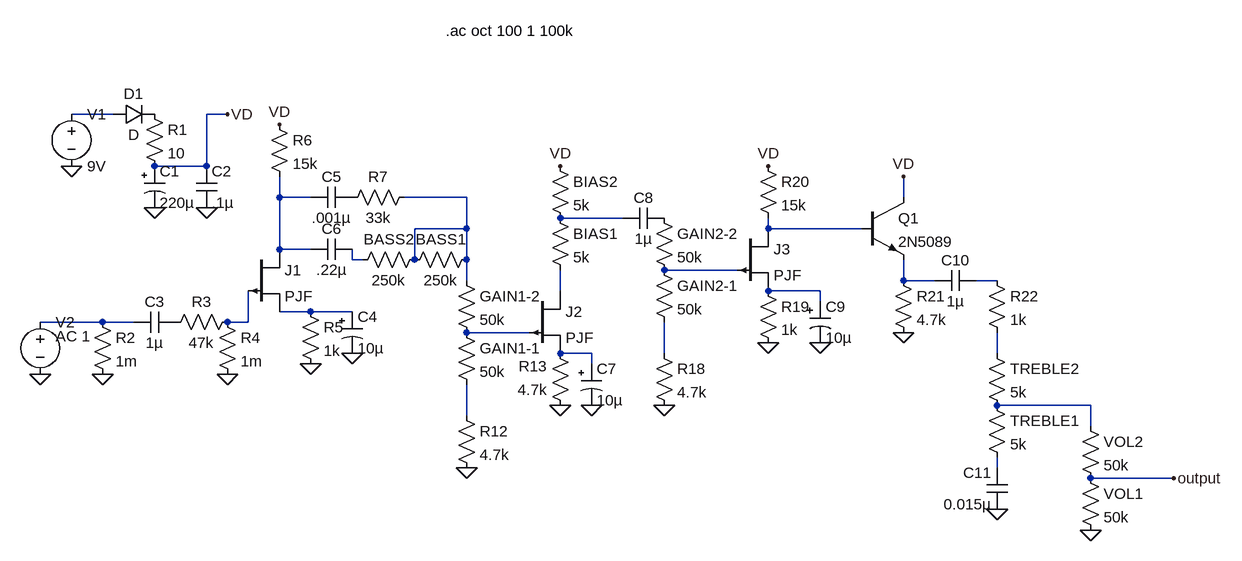
[diagram p0: schematic ssbs mini.asc]
ssbs mini.asc, the LTspice schematic file:
Version 4
SHEET 1 1656 736
WIRE -64 80 -128 80
WIRE 112 80 80 80
WIRE 80 160 80 80
WIRE 80 160 0 160
WIRE 192 208 192 176
WIRE 240 208 192 208
WIRE 480 208 384 208
WIRE 1152 208 1152 176
WIRE 720 240 624 240
WIRE 480 256 480 208
WIRE 480 256 400 256
WIRE 944 256 944 240
WIRE 1088 256 944 256
WIRE 944 272 944 256
WIRE 192 288 192 208
WIRE 240 288 192 288
WIRE 304 304 304 288
WIRE 320 304 304 304
WIRE 400 304 400 256
WIRE 480 304 480 256
WIRE 896 320 784 320
WIRE 480 336 480 304
WIRE 1152 336 1152 304
WIRE 1200 336 1152 336
WIRE 1296 336 1264 336
WIRE 624 352 624 320
WIRE 1024 352 944 352
WIRE 1024 368 1024 352
WIRE 240 384 192 384
WIRE 304 384 240 384
WIRE -80 400 -176 400
WIRE -32 400 -80 400
WIRE 144 400 144 352
WIRE 144 400 112 400
WIRE 576 416 480 416
WIRE 672 448 624 448
WIRE 784 448 784 400
WIRE 1296 448 1296 416
WIRE 672 464 672 448
WIRE 1440 528 1296 528
WIRE 480 544 480 496
WIRE 1440 560 1440 528
WIRE 1296 624 1296 608
WIRE 1568 640 1440 640
FLAG -128 160 0
FLAG -176 480 0
FLAG 0 224 0
FLAG 80 224 0
FLAG 112 80 VD
FLAG 112 480 0
FLAG -80 480 0
FLAG 240 464 0
FLAG 304 448 0
FLAG 192 96 VD
FLAG 480 624 0
FLAG 624 528 0
FLAG 672 528 0
FLAG 624 160 VD
FLAG 784 528 0
FLAG 944 432 0
FLAG 1024 432 0
FLAG 944 160 VD
FLAG 1152 176 VD
FLAG 1152 416 0
FLAG 1296 688 0
FLAG 1440 720 0
FLAG 1568 640 output
SYMBOL voltage -128 64 R0
SYMATTR InstName V1
SYMATTR Value 9V
SYMBOL voltage -176 384 R0
WINDOW 123 24 38 Left 2
SYMATTR Value2 AC 1
SYMATTR InstName V2
SYMATTR Value ""
SYMBOL diode -64 96 R270
WINDOW 0 32 32 VTop 2
WINDOW 3 0 32 VBottom 2
SYMATTR InstName D1
SYMBOL res -16 64 R0
SYMATTR InstName R1
SYMATTR Value 10
SYMBOL polcap -16 160 R0
SYMATTR InstName C1
SYMATTR Value 220µ
SYMBOL cap 64 160 R0
SYMATTR InstName C2
SYMATTR Value .1µ
SYMBOL res -96 384 R0
SYMATTR InstName R2
SYMATTR Value 1m
SYMBOL cap 32 384 R90
WINDOW 0 0 32 VBottom 2
WINDOW 3 32 32 VTop 2
SYMATTR InstName C3
SYMATTR Value 1µ
SYMBOL res 128 384 R90
WINDOW 0 0 56 VBottom 2
WINDOW 3 32 56 VTop 2
SYMATTR InstName R3
SYMATTR Value 47k
SYMBOL res 96 384 R0
SYMATTR InstName R4
SYMATTR Value 1m
SYMBOL res 224 368 R0
SYMATTR InstName R5
SYMATTR Value 1k
SYMBOL polcap 288 384 R0
SYMATTR InstName C4
SYMATTR Value 10µ
SYMBOL pjf 144 288 R0
SYMATTR InstName J1
SYMBOL res 176 80 R0
SYMATTR InstName R6
SYMATTR Value 15k
SYMBOL cap 304 192 R90
WINDOW 0 0 32 VBottom 2
WINDOW 3 32 32 VTop 2
SYMATTR InstName C5
SYMATTR Value .001µ
SYMBOL cap 304 272 R90
WINDOW 0 0 32 VBottom 2
WINDOW 3 32 32 VTop 2
SYMATTR InstName C6
SYMATTR Value .22µ
SYMBOL res 400 192 R90
WINDOW 0 0 56 VBottom 2
WINDOW 3 32 56 VTop 2
SYMATTR InstName R7
SYMATTR Value 33k
SYMBOL res 416 288 R90
WINDOW 0 0 56 VBottom 2
WINDOW 3 32 56 VTop 2
SYMATTR InstName BASS2
SYMATTR Value 250k
SYMBOL res 496 288 R90
WINDOW 0 0 56 VBottom 2
WINDOW 3 32 56 VTop 2
SYMATTR InstName BASS1
SYMATTR Value 250k
SYMBOL res 464 320 R0
SYMATTR InstName GAIN1-2
SYMATTR Value 50k
SYMBOL res 464 400 R0
SYMATTR InstName GAIN1-1
SYMATTR Value 50k
SYMBOL res 464 528 R0
SYMATTR InstName R12
SYMATTR Value 4.7k
SYMBOL pjf 576 352 R0
SYMATTR InstName J2
SYMBOL res 640 544 R180
WINDOW 0 36 76 Left 2
WINDOW 3 36 40 Left 2
SYMATTR InstName R13
SYMATTR Value 4.7k
SYMBOL polcap 656 464 R0
SYMATTR InstName C7
SYMATTR Value 10µ
SYMBOL res 608 224 R0
SYMATTR InstName BIAS1
SYMATTR Value 5k
SYMBOL res 608 144 R0
SYMATTR InstName BIAS2
SYMATTR Value 5k
SYMBOL cap 784 224 R90
WINDOW 0 0 32 VBottom 2
WINDOW 3 32 32 VTop 2
SYMATTR InstName C8
SYMATTR Value 1µ
SYMBOL res 768 224 R0
SYMATTR InstName GAIN2-2
SYMATTR Value 50k
SYMBOL res 768 304 R0
SYMATTR InstName GAIN2-1
SYMATTR Value 50k
SYMBOL res 768 432 R0
SYMATTR InstName R18
SYMATTR Value 4.7k
SYMBOL pjf 896 256 R0
SYMATTR InstName J3
SYMBOL res 928 336 R0
SYMATTR InstName R19
SYMATTR Value 1k
SYMBOL res 928 144 R0
SYMATTR InstName R20
SYMATTR Value 15k
SYMBOL polcap 1008 368 R0
SYMATTR InstName C9
SYMATTR Value 10µ
SYMBOL npn 1088 208 R0
SYMATTR InstName Q1
SYMATTR Value 2N5089
SYMBOL res 1136 320 R0
SYMATTR InstName R21
SYMATTR Value 4.7k
SYMBOL res 1280 320 R0
SYMATTR InstName R22
SYMATTR Value 1k
SYMBOL res 1280 432 R0
SYMATTR InstName TREBLE2
SYMATTR Value 5k
SYMBOL res 1280 512 R0
SYMATTR InstName TREBLE1
SYMATTR Value 5k
SYMBOL res 1424 544 R0
SYMATTR InstName VOL2
SYMATTR Value 50k
SYMBOL res 1424 624 R0
SYMATTR InstName VOL1
SYMATTR Value 50k
SYMBOL cap 1264 320 R90
WINDOW 0 0 32 VBottom 2
WINDOW 3 32 32 VTop 2
SYMATTR InstName C10
SYMATTR Value 1µ
SYMBOL cap 1312 688 R180
WINDOW 0 24 56 Left 2
WINDOW 3 24 8 Left 2
SYMATTR InstName C11
SYMATTR Value 0.015µ
TEXT 448 -48 Left 2 !.ac oct 100 1 100k

The netlist it stands for:
* ssbs mini.asc
V1 N001 0 9V
V2 N013 0 AC 1
D1 N001 P001 D
R1 P001 VD 10
C1 VD 0 220µ
C2 VD 0 .1µ
R2 N013 0 1m
C3 P002 N013 1µ
R3 N014 P002 47k
R4 N014 0 1m
R5 N012 0 1k
C4 N012 0 10µ
J1 N002 N014 N012 PJF
R6 VD N002 15k
C5 P003 N002 .001µ
C6 N006 N002 .22µ
R7 N003 P003 33k
R§BASS2 N003 N006 250k
R§BASS1 N003 N003 250k
R§GAIN1-2 N003 N015 50k
R§GAIN1-1 N015 N020 50k
R12 N020 0 4.7k
J2 N010 N015 N016 PJF
R13 0 N016 4.7k
C7 N016 0 10µ
R§BIAS1 N004 N010 5k
R§BIAS2 VD N004 5k
C8 P004 N004 1µ
R§GAIN2-2 P004 N007 50k
R§GAIN2-1 N007 N017 50k
R18 N017 0 4.7k
J3 N005 N007 N011 PJF
R19 N011 0 1k
R20 VD N005 15k
C9 N011 0 10µ
Q1 VD N005 N008 0 2N5089
R21 N008 0 4.7k
R22 N009 N018 1k
R§TREBLE2 N018 N019 5k
R§TREBLE1 N019 N021 5k
R§VOL2 N019 output 50k
R§VOL1 output 0 50k
C10 N009 N008 1µ
C11 0 N021 0.015µ
.model D D
.lib standard.dio
.model NPN NPN
.model PNP PNP
.lib standard.bjt
.model NJF NJF
.model PJF PJF
.lib standard.jft
.ac oct 100 1 100k
.backanno
.end